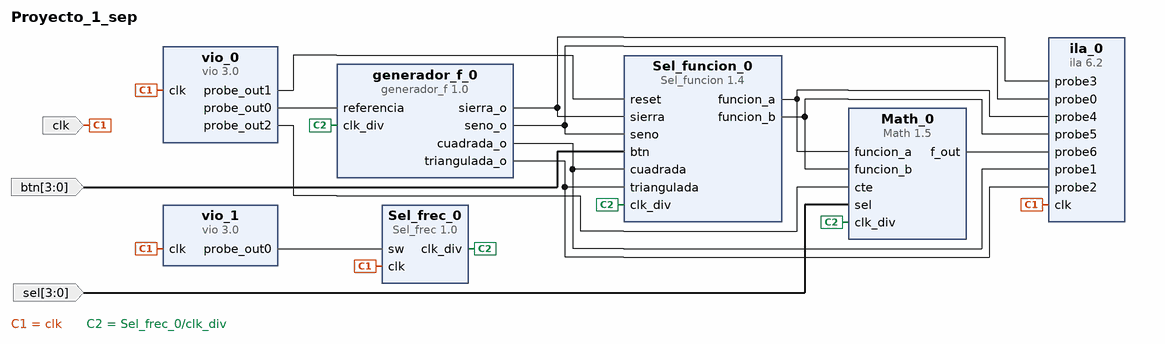
[diagram p0: block diagram of the top level]
# Vivado block design Proyecto_1_sep, xc7z010clg400-1, Vivado 2020.1
create_bd_design Proyecto_1_sep

create_bd_port -dir I -type clk clk
create_bd_port -dir I -from 3 -to 0 btn
create_bd_port -dir I -from 3 -to 0 sel

create_bd_cell -type ip -vlnv xilinx.com:user:Sel_frec:1.0 Sel_frec_0
create_bd_cell -type ip -vlnv xilinx.com:user:Sel_funcion:1.4 Sel_funcion_0
create_bd_cell -type ip -vlnv xilinx.com:user:generador_f:1.0 generador_f_0
create_bd_cell -type ip -vlnv xilinx.com:ip:ila:6.2 ila_0
set_property -dict [list \
  CONFIG.C_DATA_DEPTH 8192 \
  CONFIG.C_ENABLE_ILA_AXI_MON false \
  CONFIG.C_MONITOR_TYPE Native \
  CONFIG.C_NUM_OF_PROBES 7 \
  CONFIG.C_PROBE0_WIDTH 8 \
  CONFIG.C_PROBE1_WIDTH 8 \
  CONFIG.C_PROBE2_WIDTH 8 \
  CONFIG.C_PROBE3_WIDTH 8 \
  CONFIG.C_PROBE4_WIDTH 8 \
  CONFIG.C_PROBE5_WIDTH 8 \
  CONFIG.C_PROBE6_WIDTH 16 \
] [get_bd_cells ila_0]
create_bd_cell -type ip -vlnv xilinx.com:ip:vio:3.0 vio_0
set_property -dict [list \
  CONFIG.C_NUM_PROBE_IN 0 \
  CONFIG.C_NUM_PROBE_OUT 3 \
  CONFIG.C_PROBE_IN0_WIDTH 8 \
  CONFIG.C_PROBE_IN2_WIDTH 8 \
  CONFIG.C_PROBE_OUT0_WIDTH 8 \
  CONFIG.C_PROBE_OUT2_WIDTH 8 \
] [get_bd_cells vio_0]
create_bd_cell -type ip -vlnv xilinx.com:ip:vio:3.0 vio_1
set_property -dict {CONFIG.C_NUM_PROBE_IN 0 CONFIG.C_PROBE_OUT0_WIDTH 4} [get_bd_cells vio_1]
create_bd_cell -type ip -vlnv xilinx.com:user:Math:1.5 Math_0

# ---- connections ----

connect_bd_net -net clk_0_1 [get_bd_ports clk] [get_bd_pins Sel_frec_0/clk] [get_bd_pins ila_0/clk] [get_bd_pins vio_0/clk] [get_bd_pins vio_1/clk]
connect_bd_net [get_bd_pins vio_1/probe_out0] [get_bd_pins Sel_frec_0/sw]
connect_bd_net [get_bd_pins Sel_frec_0/clk_div] [get_bd_pins Sel_funcion_0/clk_div] [get_bd_pins generador_f_0/clk_div] [get_bd_pins Math_0/clk_div]
connect_bd_net -net Dientes_de_sierra_0_sierra [get_bd_pins generador_f_0/sierra_o] [get_bd_pins Sel_funcion_0/sierra] [get_bd_pins ila_0/probe3]
connect_bd_net -net RAM_test_0_seno [get_bd_pins generador_f_0/seno_o] [get_bd_pins Sel_funcion_0/seno] [get_bd_pins ila_0/probe0]
connect_bd_net -net comp_cuadrada_0_cuadrada [get_bd_pins generador_f_0/cuadrada_o] [get_bd_pins Sel_funcion_0/cuadrada] [get_bd_pins ila_0/probe1]
connect_bd_net -net Triangular_0_triangulada [get_bd_pins generador_f_0/triangulada_o] \
  [get_bd_pins Sel_funcion_0/triangulada] [get_bd_pins ila_0/probe2]
connect_bd_net -net btn_0_1 [get_bd_ports btn] [get_bd_pins Sel_funcion_0/btn]
connect_bd_net [get_bd_pins vio_0/probe_out1] [get_bd_pins Sel_funcion_0/reset]
connect_bd_net [get_bd_pins Sel_funcion_0/funcion_a] [get_bd_pins ila_0/probe4] [get_bd_pins Math_0/funcion_a]
connect_bd_net [get_bd_pins Sel_funcion_0/funcion_b] [get_bd_pins ila_0/probe5] [get_bd_pins Math_0/funcion_b]
connect_bd_net [get_bd_pins vio_0/probe_out2] [get_bd_pins Math_0/cte]
connect_bd_net -net sel_0_1 [get_bd_ports sel] [get_bd_pins Math_0/sel]
connect_bd_net [get_bd_pins Math_0/f_out] [get_bd_pins ila_0/probe6]
connect_bd_net [get_bd_pins vio_0/probe_out0] [get_bd_pins generador_f_0/referencia]

validate_bd_design
save_bd_design
